# Altium project OUT_DOOR.PrjPcb
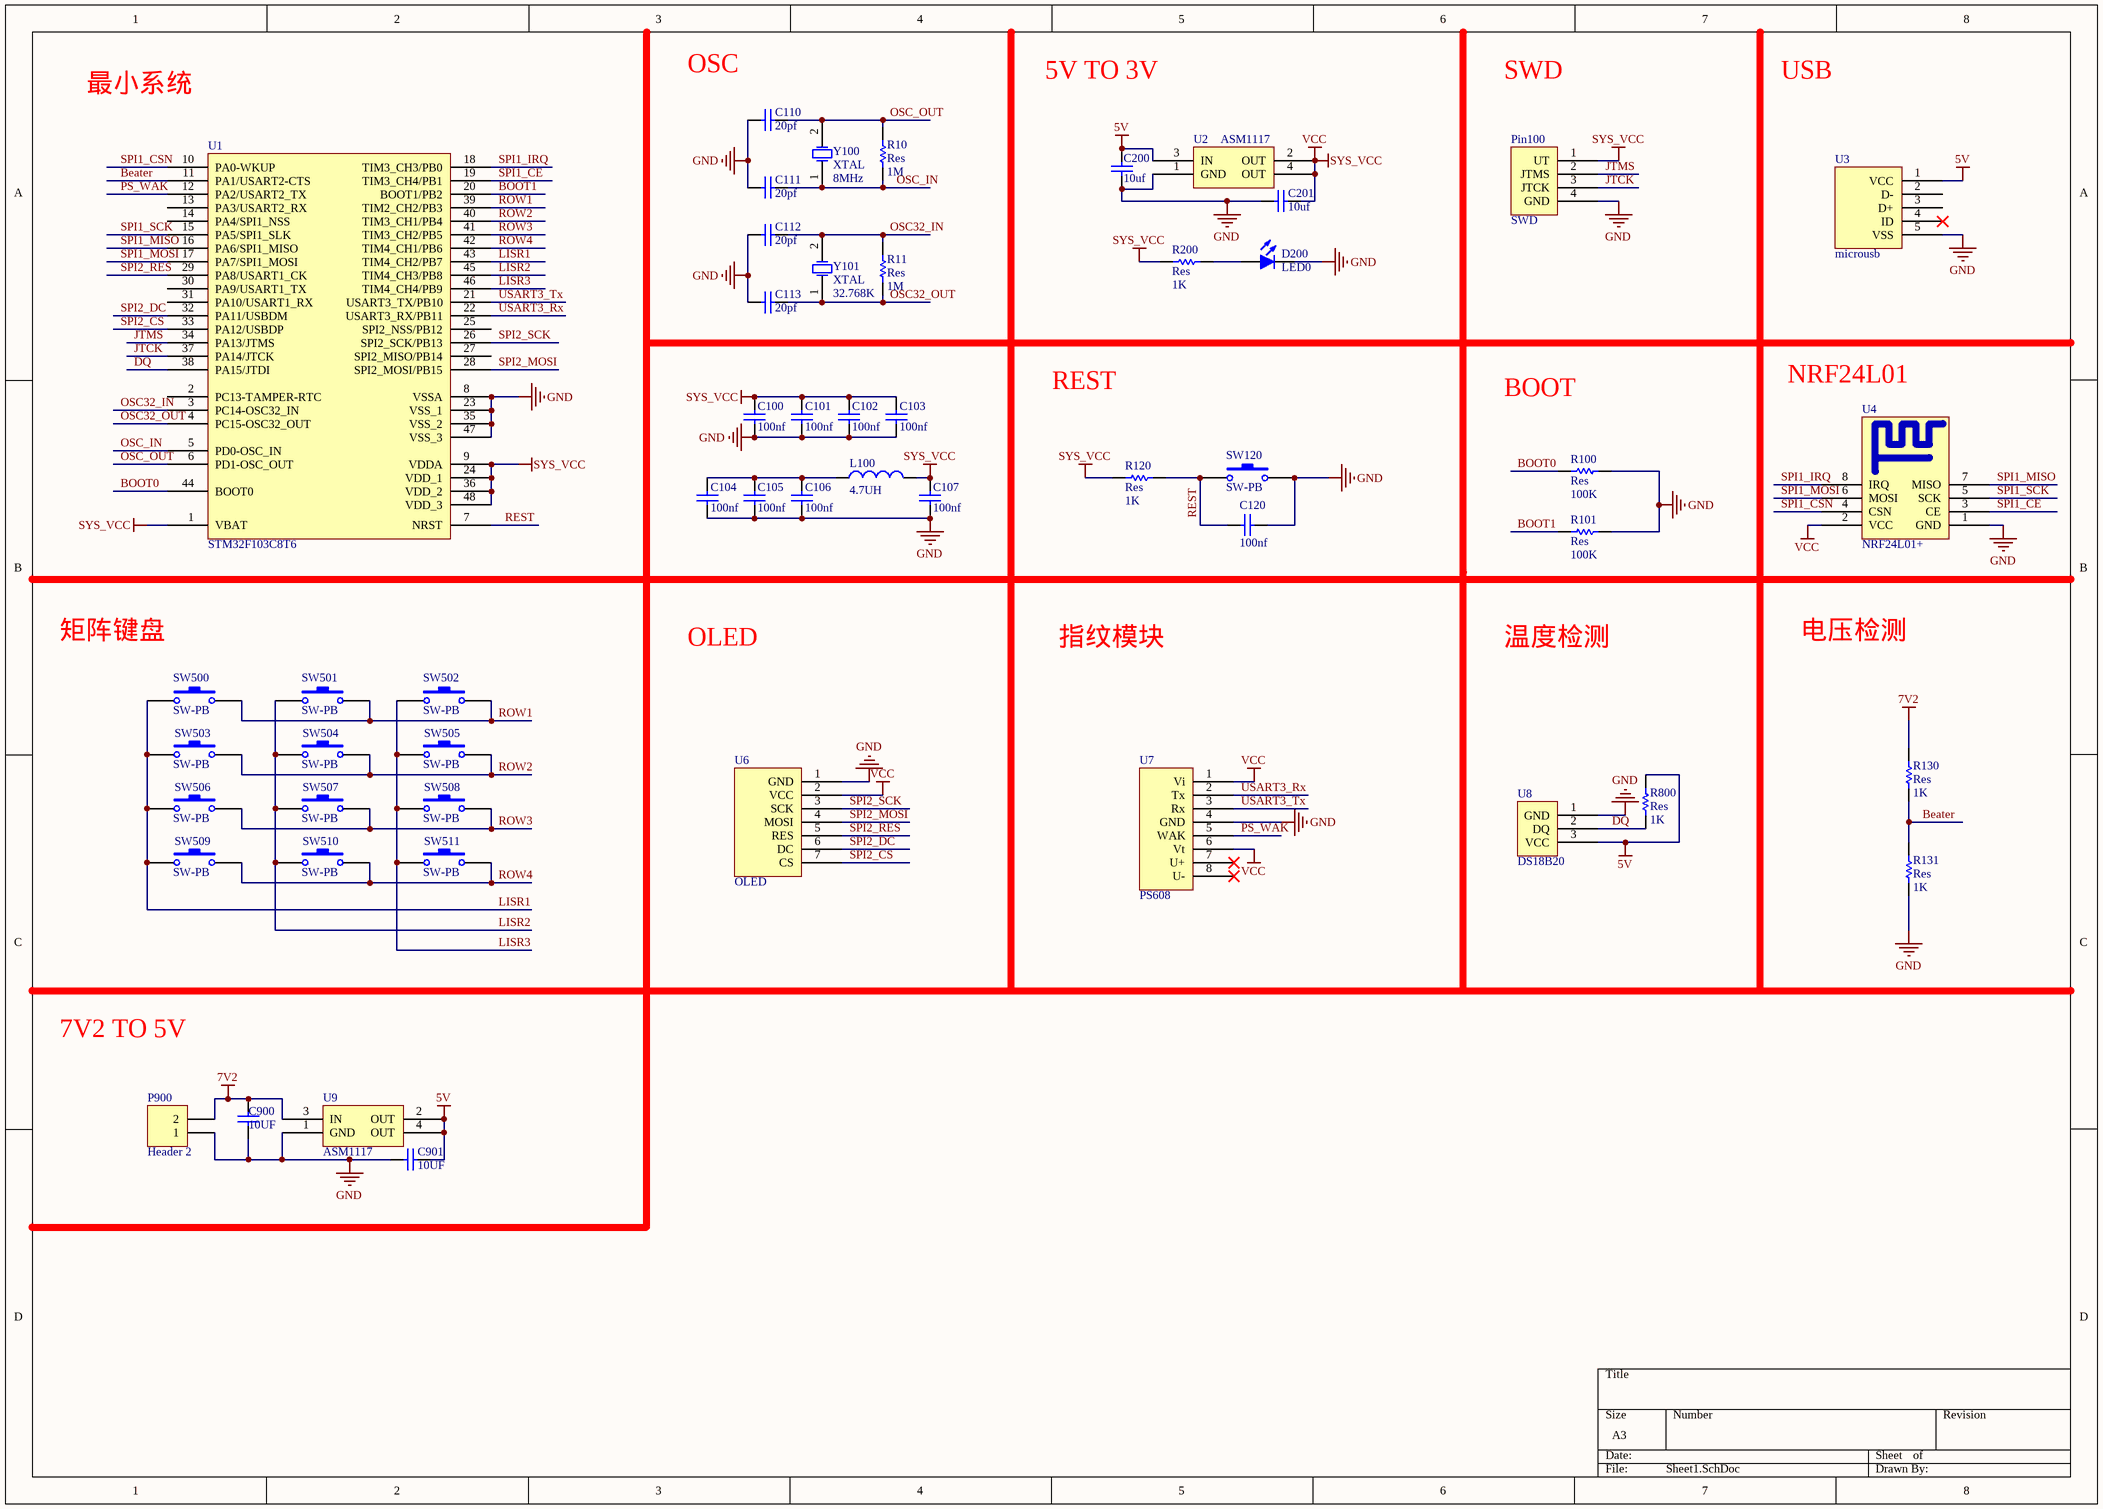
[diagram p0: Sheet1.SchDoc]
1 sheet, 53 parts. Net scope: global (net labels, ports and power ports of the same name join across sheets).
Board file: PCB1.PcbDoc

## Sheet Sheet1.SchDoc
size A3

### Parts
C100  100nf  [0805]
C101  100nf  [0805]
C102  100nf  [0805]
C103  100nf  [0805]
C104  100nf  [0805]
C105  100nf  [0805]
C106  100nf  [0805]
C107  100nf  [0805]
C110  20pf  [0805]
C111  20pf  [0805]
C112  20pf  [0805]
C113  20pf  [0805]
C120  100nf  [Cap0805]
C200  10uf  [0805]
C201  10uf  [0805]
C900  10UF  [Cap0805]
C901  10UF  [Cap0805]
D200  LED0  [LED-0805]
L100  value 4.7UH  [0805]  (hidden comment: Inductor)
P900  Header 2  [DC003]
Pin100  SWD  [HDR1X4]
R10  Res  Vaule: 1M  [0805]
R11  Res  Vaule: 1M  [0805]
R100  Res  Vaule: 100K  [0805]
R101  Res  Vaule: 100K  [0805]
R120  Res  Vaule: 1K  [0805]
R130  Res  Vaule: 1K  [0805]
R131  Res  Vaule: 1K  [0805]
R200  Res  Vaule: 1K  [0805]
R800  Res  Vaule: 1K  [0805]
SW120  SW-PB  [SW-PB]
SW500  SW-PB  [SW-PB]
SW501  SW-PB  [SW-PB]
SW502  SW-PB  [SW-PB]
SW503  SW-PB  [SW-PB]
SW504  SW-PB  [SW-PB]
SW505  SW-PB  [SW-PB]
SW506  SW-PB  [SW-PB]
SW507  SW-PB  [SW-PB]
SW508  SW-PB  [SW-PB]
SW509  SW-PB  [SW-PB]
SW510  SW-PB  [SW-PB]
SW511  SW-PB  [SW-PB]
U1  STM32F103C8T6  [LQFP-48]
U2  ASM1117  [SOT-223]
U3  microusb  [microusb]
U4  NRF24L01+  [DIP8NRF]
U6  OLED  [OLED]
U7  PS608  [HDR1X8]
U8  DS18B20  [TO-92]
U9  ASM1117  [SOT-223]
Y100  XTAL  [X-HC49U]
Y101  XTAL  [308晶振]

### Nets
5V: C200.2 C901.1 R800.2 U2.3(IN) U3.1(VCC) U8.3(VCC) U9.2(OUT) U9.4(OUT)
7V2: C900.2 P900.2 R130.2 U9.3(IN)
GND: C100.1 C101.1 C102.1 C103.1 C104.1 C105.1 C106.1 C107.1 C110.2 C111.2 C112.2 C113.2 C120.2 C200.1 C201.2 C900.1 C901.2 D200.2(K) P900.1 Pin100.4(GND) R100.2 R101.2 R131.1 SW120.2 U1.8(VSSA) U1.23(VSS_1) U1.35(VSS_2) U1.47(VSS_3) U2.1(GND) U3.5(VSS) U4.1(GND) U6.1(GND) U7.4(GND) U8.1(GND) U9.1(GND)
SYS_VCC: C100.2 C101.2 C102.2 C103.2 C107.2 C201.1 L100.2 Pin100.1(UT) R120.1 R200.1 U1.1(VBAT) U1.9(VDDA) U1.24(VDD_1) U1.36(VDD_2) U1.48(VDD_3) U2.2(OUT) U2.4(OUT) U4.2(VCC) U6.2(VCC) U7.1(Vi) U7.6(Vt)  [also labelled VCC]
Beater: R130.1 R131.2 U1.11(PA1/USART2-CTS)
BOOT0: R100.1 U1.44(BOOT0)
BOOT1: R101.1 U1.20(BOOT1/PB2)
DQ: R800.1 U1.38(PA15/JTDI) U8.2(DQ)
JTCK: Pin100.3(JTCK) U1.37(PA14/JTCK)
JTMS: Pin100.2(JTMS) U1.34(PA13/JTMS)
LISR1: SW500.1 SW503.1 SW506.1 SW509.1 U1.43(TIM4_CH2/PB7)
LISR2: SW501.1 SW504.1 SW507.1 SW510.1 U1.45(TIM4_CH3/PB8)
LISR3: SW502.1 SW505.1 SW508.1 SW511.1 U1.46(TIM4_CH4/PB9)
OSC32_IN: C112.1 R11.2 U1.3(PC14-OSC32_IN) Y101.2(OSC2)
OSC32_OUT: C113.1 R11.1 U1.4(PC15-OSC32_OUT) Y101.1(OSC1)
OSC_IN: C111.1 R10.1 U1.5(PD0-OSC_IN) Y100.1(OSC1)
OSC_OUT: C110.1 R10.2 U1.6(PD1-OSC_OUT) Y100.2(OSC2)
PS_WAK: U1.12(PA2/USART2_TX) U7.5(WAK)
REST: C120.1 R120.2 SW120.1 U1.7(NRST)
ROW1: SW500.2 SW501.2 SW502.2 U1.39(TIM2_CH2/PB3)
ROW2: SW503.2 SW504.2 SW505.2 U1.40(TIM3_CH1/PB4)
ROW3: SW506.2 SW507.2 SW508.2 U1.41(TIM3_CH2/PB5)
ROW4: SW509.2 SW510.2 SW511.2 U1.42(TIM4_CH1/PB6)
SPI1_CE: U1.19(TIM3_CH4/PB1) U4.3(CE)
SPI1_CSN: U1.10(PA0-WKUP) U4.4(CSN)
SPI1_IRQ: U1.18(TIM3_CH3/PB0) U4.8(IRQ)
SPI1_MISO: U1.16(PA6/SPI1_MISO) U4.7(MISO)
SPI1_MOSI: U1.17(PA7/SPI1_MOSI) U4.6(MOSI)
SPI1_SCK: U1.15(PA5/SPI1_SLK) U4.5(SCK)
SPI2_CS: U1.33(PA12/USBDP) U6.7(CS)
SPI2_DC: U1.32(PA11/USBDM) U6.6(DC)
SPI2_MOSI: U1.28(SPI2_MOSI/PB15) U6.4(MOSI)
SPI2_RES: U1.29(PA8/USART1_CK) U6.5(RES)
SPI2_SCK: U1.26(SPI2_SCK/PB13) U6.3(SCK)
USART3_Rx: U1.22(USART3_RX/PB11) U7.2(Tx)
USART3_Tx: U1.21(USART3_TX/PB10) U7.3(Rx)
NetC104_2: C104.2 C105.2 C106.2 L100.1
NetD200_1: D200.1(A) R200.2

Not connected (* = marked no-connect by the designer): U1 2(PC13-TAMPER-RTC) 13(PA3/USART2_RX) 14(PA4/SPI1_NSS) 25(SPI2_NSS/PB12) 27(SPI2_MISO/PB14) 30(PA9/USART1_TX) 31(PA10/USART1_RX); U3 2(D-) 3(D+) 4(ID)*; U7 7(U+)* 8(U-)*

### Notes on the sheet
- 最小系统
- (near C110) OSC
- 5V TO 3V
- SWD
- USB
- REST
- BOOT
- NRF24L01
- 矩阵键盘
- OLED
- 指纹模块
- 温度检测
- 电压检测
- 7V2 TO 5V
- (in symbol XTAL) 8MHz; 32.768K

### Library data of the parts
C100-C107 C110-C113 C120 C200 C201 C900 C901 = Cap: 0805贴片电容
D200 = LED0: 0805贴片LED灯
L100 = Inductor: Code_IEC: 1005; Published: 8-Jun-2000; LatestRevisionDate: 29-May-2009; LatestRevisionNote: IPC-7351 Footprint Added.; PackageReference: 0402-A; Publisher: Altium Limited; PackageDescription: Chip Inductor; Code_JEITA: 0402
P900 = Header 2: Header, 2-Pin; LatestRevisionDate: 17-Jul-2002; LatestRevisionNote: Re-released for DXP Platform.; Publisher: Altium Limited
Pin100 = SWD: SWD下载端口
R10 R11 R100 R101 R120 R130 R131 R200 R800 = Res: 0805贴片电阻
SW120 SW500-SW511 = SW-PB: 贴片按键
U1 = STM32F103C8T6: Cortex-M3内核单片机
U2 U9 = ASM1117: 线性稳压芯片
U4 = NRF24L01+: 直插式NRF
U7 = PS608: 指纹模块
U8 = DS18B20: 温度传感器
Y100 Y101 = XTAL: 无源晶振